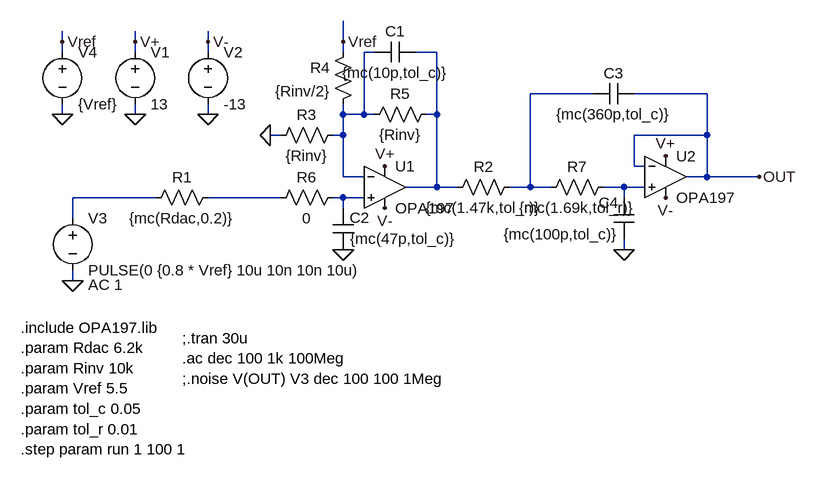
[diagram p0: schematic Design Monte-Carlo tolerance analysis.asc]
Design Monte-Carlo tolerance analysis.asc, the LTspice schematic file:
Version 4
SHEET 1 1260 716
WIRE 128 128 128 112
WIRE 240 128 240 112
WIRE 352 128 352 112
WIRE 560 128 560 96
WIRE 128 144 128 128
WIRE 240 144 240 128
WIRE 352 144 352 128
WIRE 560 144 560 128
WIRE 608 144 592 144
WIRE 704 144 672 144
WIRE 944 208 848 208
WIRE 1120 208 1008 208
WIRE 128 240 128 224
WIRE 240 240 240 224
WIRE 352 240 352 224
WIRE 560 240 560 224
WIRE 592 240 592 144
WIRE 592 240 560 240
WIRE 608 240 592 240
WIRE 704 240 704 144
WIRE 704 240 688 240
WIRE 464 272 448 272
WIRE 560 272 560 240
WIRE 560 272 544 272
WIRE 1120 272 1120 208
WIRE 1120 272 1008 272
WIRE 1008 320 1008 272
WIRE 1024 320 1008 320
WIRE 560 336 560 272
WIRE 592 336 560 336
WIRE 1120 336 1120 272
WIRE 1120 336 1088 336
WIRE 1200 336 1120 336
WIRE 704 352 704 240
WIRE 704 352 656 352
WIRE 736 352 704 352
WIRE 848 352 848 208
WIRE 848 352 816 352
WIRE 880 352 848 352
WIRE 992 352 960 352
WIRE 1024 352 992 352
WIRE 272 368 144 368
WIRE 464 368 352 368
WIRE 560 368 544 368
WIRE 592 368 560 368
WIRE 992 368 992 352
WIRE 560 384 560 368
WIRE 144 400 144 368
WIRE 992 448 992 432
WIRE 144 496 144 480
FLAG 240 240 0
FLAG 240 128 V+
FLAG 352 240 0
FLAG 352 128 V-
FLAG 624 320 V+
FLAG 624 384 V-
FLAG 144 496 0
FLAG 128 240 0
FLAG 128 128 Vref
FLAG 560 128 Vref
FLAG 448 272 0
FLAG 560 448 0
FLAG 1056 304 V+
FLAG 1056 368 V-
FLAG 992 448 0
FLAG 1200 336 OUT
SYMBOL Opamps/opamp2 624 288 R0
SYMATTR InstName U1
SYMATTR Value OPA197
SYMBOL voltage 240 128 R0
SYMATTR InstName V1
SYMATTR Value 13
SYMBOL voltage 352 128 R0
SYMATTR InstName V2
SYMATTR Value -13
SYMBOL voltage 144 384 R0
WINDOW 123 24 118 Left 2
SYMATTR Value2 AC 1
SYMATTR InstName V3
SYMATTR Value PULSE(0 {0.8 * Vref} 10u 10n 10n 10u)
SYMBOL res 368 352 R90
WINDOW 0 0 56 VBottom 2
WINDOW 3 32 56 VTop 2
SYMATTR InstName R1
SYMATTR Value {mc(Rdac,0.2)}
SYMBOL res 576 128 M0
SYMATTR InstName R4
SYMATTR Value {Rinv/2}
SYMBOL res 704 224 R90
WINDOW 0 0 56 VBottom 2
WINDOW 3 32 56 VTop 2
SYMATTR InstName R5
SYMATTR Value {Rinv}
SYMBOL voltage 128 128 R0
SYMATTR InstName V4
SYMATTR Value {Vref}
SYMBOL res 560 256 R90
WINDOW 0 0 56 VBottom 2
WINDOW 3 32 56 VTop 2
SYMATTR InstName R3
SYMATTR Value {Rinv}
SYMBOL cap 544 384 R0
WINDOW 0 26 15 Left 2
WINDOW 3 27 47 Left 2
SYMATTR InstName C2
SYMATTR Value {mc(47p,tol_c)}
SYMBOL res 560 352 R90
WINDOW 0 0 56 VBottom 2
WINDOW 3 32 56 VTop 2
SYMATTR InstName R6
SYMATTR Value 0
SYMBOL cap 672 128 R90
WINDOW 0 0 32 VBottom 2
WINDOW 3 32 32 VTop 2
SYMATTR InstName C1
SYMATTR Value {mc(10p,tol_c)}
SYMBOL res 832 336 R90
WINDOW 0 0 56 VBottom 2
WINDOW 3 32 56 VTop 2
SYMATTR InstName R2
SYMATTR Value {mc(1.47k,tol_r)}
SYMBOL res 976 336 R90
WINDOW 0 0 56 VBottom 2
WINDOW 3 32 56 VTop 2
SYMATTR InstName R7
SYMATTR Value {mc(1.69k,tol_r)}
SYMBOL cap 1008 192 R90
WINDOW 0 0 32 VBottom 2
WINDOW 3 32 32 VTop 2
SYMATTR InstName C3
SYMATTR Value {mc(360p,tol_c)}
SYMBOL Opamps/opamp2 1056 272 R0
SYMATTR InstName U2
SYMATTR Value OPA197
SYMBOL cap 1008 432 R180
WINDOW 0 24 56 Left 2
WINDOW 3 24 8 Left 2
SYMATTR InstName C4
SYMATTR Value {mc(100p,tol_c)}
TEXT 64 568 Left 2 !.include OPA197.lib\n.param Rdac 6.2k\n.param Rinv 10k\n.param Vref 5.5\n.param tol_c 0.05\n.param tol_r 0.01\n.step param run 1 100 1
TEXT 312 584 Left 2 !;.tran 30u\n.ac dec 100 1k 100Meg\n;.noise V(OUT) V3 dec 100 100 1Meg

The netlist it stands for:
* Design Monte-Carlo tolerance analysis.asc
XU1 N007 N001 V+ V- N002 OPA197  ; pins In+ In- V+ V- OUT
V1 V+ 0 13
V2 V- 0 -13
V3 N005 0 PULSE(0 {0.8 * Vref} 10u 10n 10n 10u) AC 1
R1 N006 N005 {mc(Rdac,0.2)}
R4 Vref N001 {Rinv/2}
R5 N002 N001 {Rinv}
V4 Vref 0 {Vref}
R3 N001 0 {Rinv}
C2 N007 0 {mc(47p,tol_c)}
R6 N007 N006 0
C1 N002 N001 {mc(10p,tol_c)}
R2 N003 N002 {mc(1.47k,tol_r)}
R7 N004 N003 {mc(1.69k,tol_r)}
C3 OUT N003 {mc(360p,tol_c)}
XU2 N004 OUT V+ V- OUT OPA197  ; pins In+ In- V+ V- OUT
C4 0 N004 {mc(100p,tol_c)}
.include OPA197.lib
.param Rdac 6.2k
.param Rinv 10k
.param Vref 5.5
.param tol_c 0.05
.param tol_r 0.01
.step param run 1 100 1
;.tran 30u
.ac dec 100 1k 100Meg
;.noise V(OUT) V3 dec 100 100 1Meg
.backanno
.end